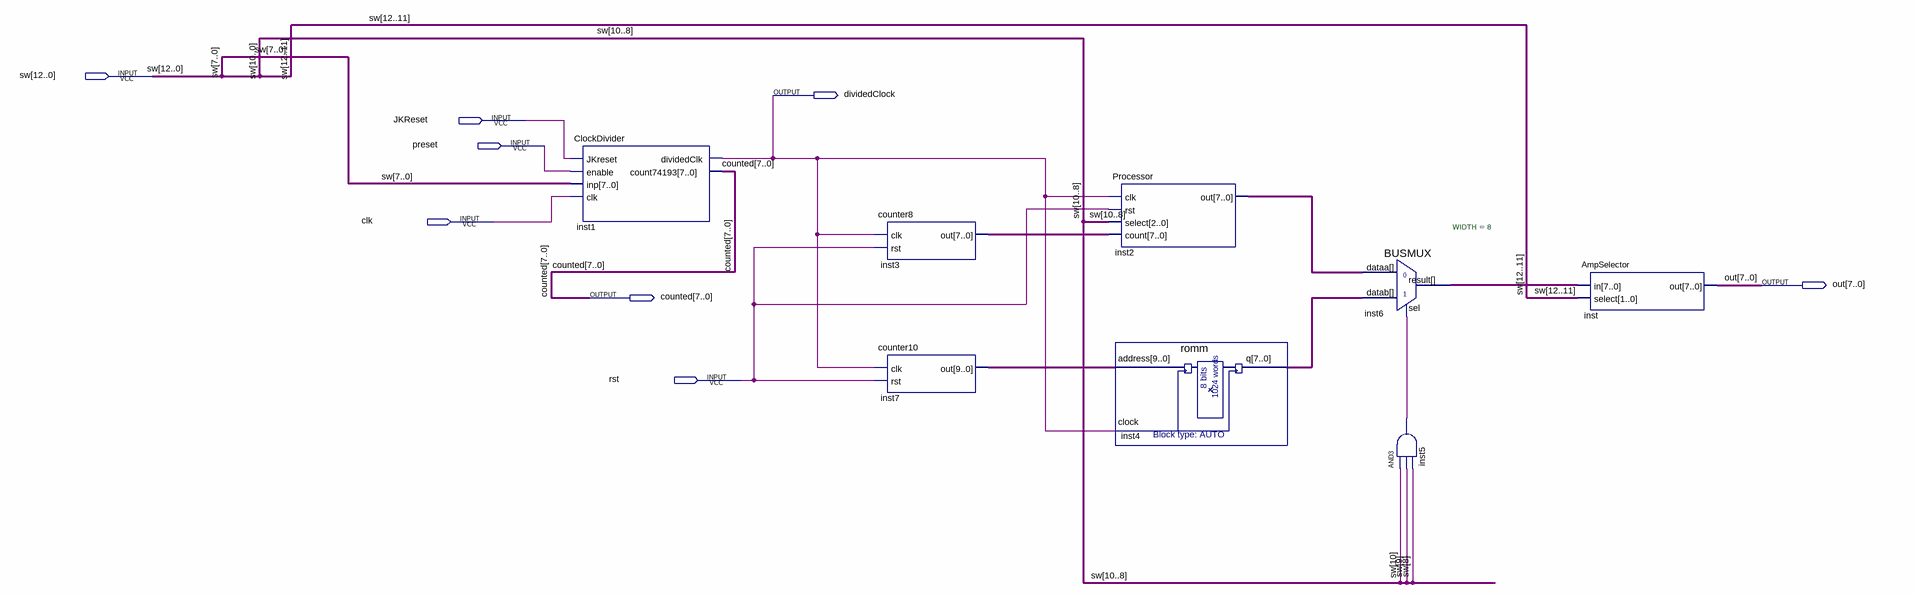
[diagram p0: schematic sheet]
// Quartus schematic FuncGenWithFreqAndAmp.bdf as structural Verilog: 8 symbols, 8 pins
module FuncGenWithFreqAndAmp (
  input  [12:0] sw,
  input  JKReset,
  input  preset,
  input  clk,
  input  rst,
  output dividedClock,
  output [7:0] out,
  output [7:0] counted
);

  wire inst5_out;
  wire [7:0] inst2_out, inst3_out, inst4_q, inst6_result;
  wire [9:0] inst7_out;

  ClockDivider inst1 (
    .JKreset(JKReset), .enable(preset), .inp(sw[7:0]), .clk(clk), .dividedClk(dividedClock),
    .count74193(counted));
  counter8 inst3 (.clk(dividedClock), .rst(rst), .out(inst3_out));
  counter10 inst7 (.clk(dividedClock), .rst(rst), .out(inst7_out));
  Processor inst2 (.clk(dividedClock), .rst(rst), .select(sw[10:8]), .count(inst3_out), .out(inst2_out));
  romm inst4 (.address(inst7_out), .clock(dividedClock), .q(inst4_q));
  BUSMUX #(.WIDTH(8)) inst6 (.datab(inst4_q), .sel(inst5_out), .dataa(inst2_out), .result(inst6_result));
  and inst5 (inst5_out, sw[10], sw[9], sw[8]);
  AmpSelector inst (.in(inst6_result), .select(sw[12:11]), .out(out));
endmodule
